# EAGLE design DP_current_measure_V3_extension (EAGLE 9.6.0)
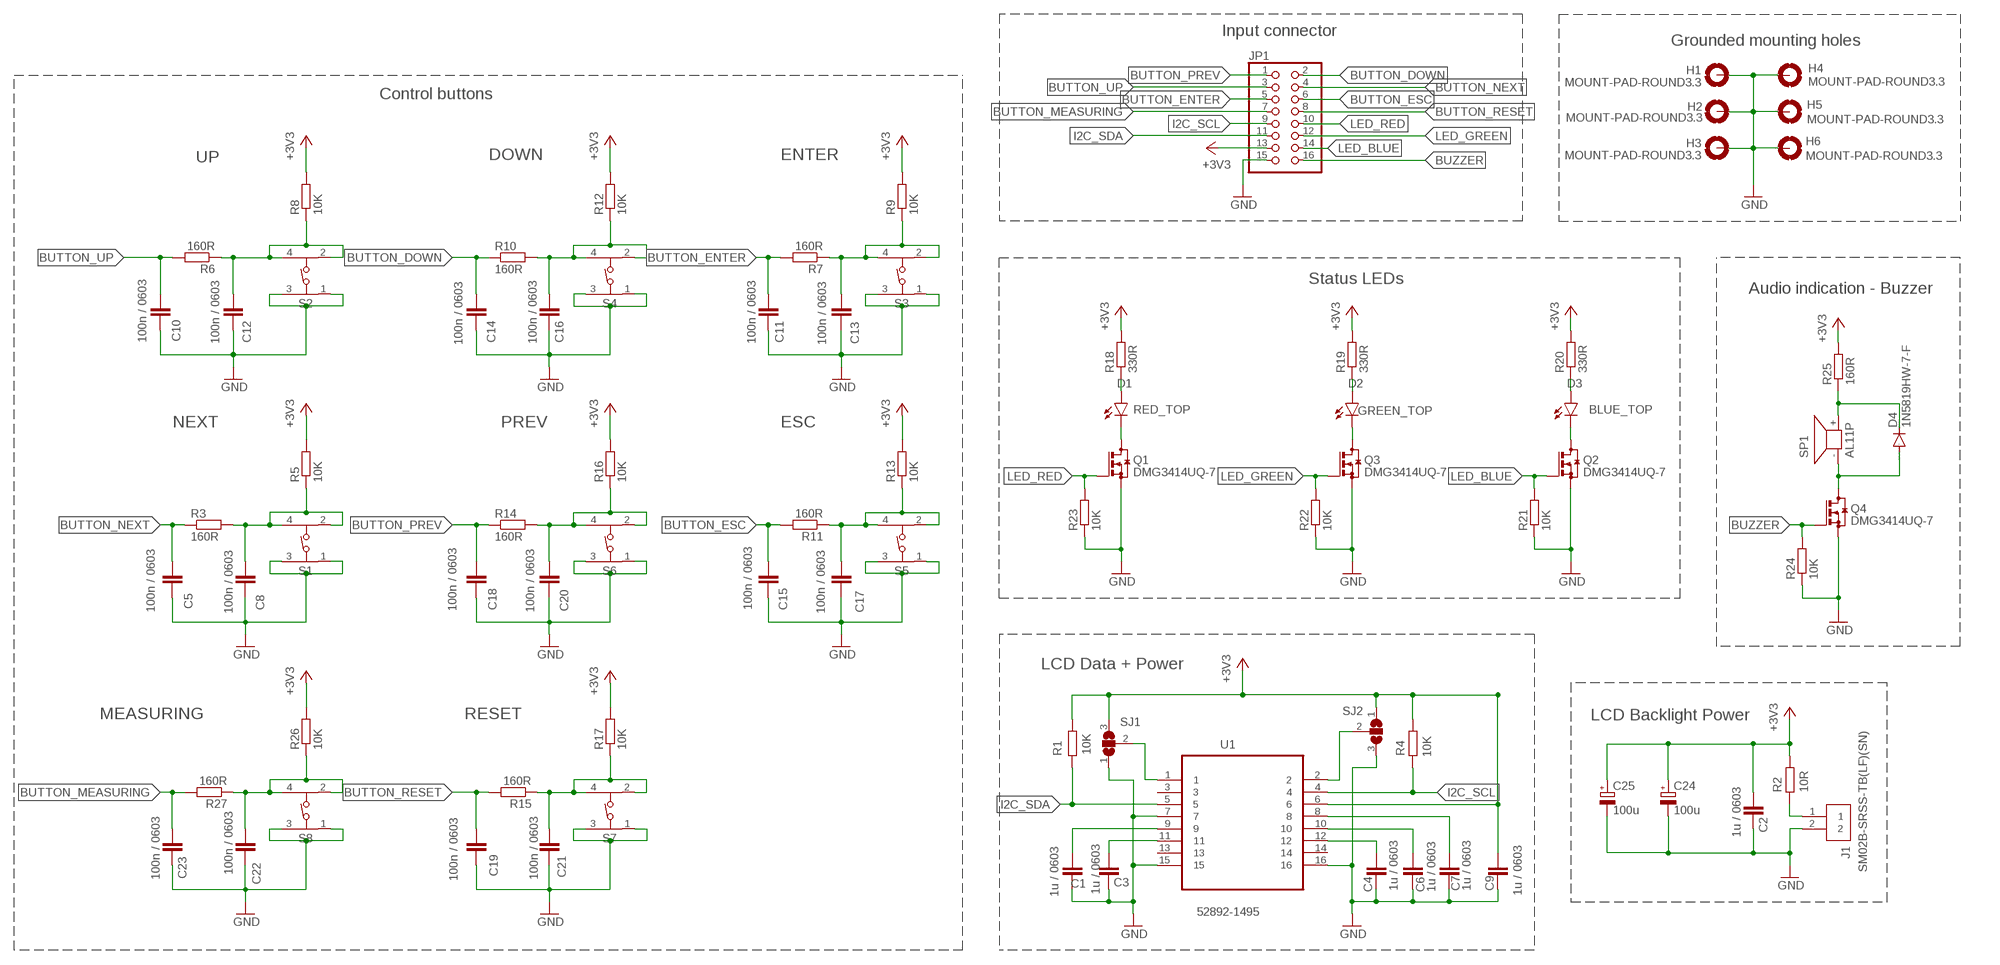
[diagram p0: schematic, sheet 1]

## Parts
C1  1u / 0603  C-EUC0603  [C0603]
C2  1u / 0603  C-EUC0603  [C0603]
C3  1u / 0603  C-EUC0603  [C0603]
C4  1u / 0603  C-EUC0603  [C0603]
C5  100n / 0603  C-EUC0603  [C0603]
C6  1u / 0603  C-EUC0603  [C0603]
C7  1u / 0603  C-EUC0603  [C0603]
C8  100n / 0603  C-EUC0603  [C0603]
C9  1u / 0603  C-EUC0603  [C0603]
C10  100n / 0603  C-EUC0603  [C0603]
C11  100n / 0603  C-EUC0603  [C0603]
C12  100n / 0603  C-EUC0603  [C0603]
C13  100n / 0603  C-EUC0603  [C0603]
C14  100n / 0603  C-EUC0603  [C0603]
C15  100n / 0603  C-EUC0603  [C0603]
C16  100n / 0603  C-EUC0603  [C0603]
C17  100n / 0603  C-EUC0603  [C0603]
C18  100n / 0603  C-EUC0603  [C0603]
C19  100n / 0603  C-EUC0603  [C0603]
C20  100n / 0603  C-EUC0603  [C0603]
C21  100n / 0603  C-EUC0603  [C0603]
C22  100n / 0603  C-EUC0603  [C0603]
C23  100n / 0603  C-EUC0603  [C0603]
C24  100u  CPOL-EUSMCB  [SMC_B]
C25  100u  CPOL-EUSMCB  [SMC_B]
D1  RED_TOP  LTST-C190KRKT  [LED-0603]
D2  GREEN_TOP  LTST-C190KRKT  [LED-0603]
D3  BLUE_TOP  LTST-C190KRKT  [LED-0603]
D4  1N5819HW-7-F  CGRM4001-G  [SOD-123_MINI-SMA]
H1  MOUNT-PAD-ROUND3.3  [3,3-PAD]
H2  MOUNT-PAD-ROUND3.3  [3,3-PAD]
H3  MOUNT-PAD-ROUND3.3  [3,3-PAD]
H4  MOUNT-PAD-ROUND3.3  [3,3-PAD]
H5  MOUNT-PAD-ROUND3.3  [3,3-PAD]
H6  MOUNT-PAD-ROUND3.3  [3,3-PAD]
J1  SM02B-SRSS-TB(LF)(SN)  [SM02B-SRSS-TB(LF)(SN)]
JP1  PINHD-2X8  [2X08]
Q1  DMG3414UQ-7  BSS123  [SOT23]
Q2  DMG3414UQ-7  BSS123  [SOT23]
Q3  DMG3414UQ-7  BSS123  [SOT23]
Q4  DMG3414UQ-7  BSS123  [SOT23]
R1  10K  R-EU_R0603  [R0603]
R2  10R  R-EU_R0603  [R0603]
R3  160R  R-EU_R0603  [R0603]
R4  10K  R-EU_R0603  [R0603]
R5  10K  R-EU_R0603  [R0603]
R6  160R  R-EU_R0603  [R0603]
R7  160R  R-EU_R0603  [R0603]
R8  10K  R-EU_R0603  [R0603]
R9  10K  R-EU_R0603  [R0603]
R10  160R  R-EU_R0603  [R0603]
R11  160R  R-EU_R0603  [R0603]
R12  10K  R-EU_R0603  [R0603]
R13  10K  R-EU_R0603  [R0603]
R14  160R  R-EU_R0603  [R0603]
R15  160R  R-EU_R0603  [R0603]
R16  10K  R-EU_R0603  [R0603]
R17  10K  R-EU_R0603  [R0603]
R18  330R  R-EU_R0603  [R0603]
R19  330R  R-EU_R0603  [R0603]
R20  330R  R-EU_R0603  [R0603]
R21  10K  R-EU_R0603  [R0603]
R22  10K  R-EU_R0603  [R0603]
R23  10K  R-EU_R0603  [R0603]
R24  10K  R-EU_R0603  [R0603]
R25  160R  R-EU_R0603  [R0603]
R26  10K  R-EU_R0603  [R0603]
R27  160R  R-EU_R0603  [R0603]
S1  430152095826  [430152095826]
S2  430152095826  [430152095826]
S3  430152095826  [430152095826]
S4  430152095826  [430152095826]
S5  430152095826  [430152095826]
S6  430152095826  [430152095826]
S7  430152095826  [430152095826]
S8  430152095826  [430152095826]
SJ1  SJ2W  [SJ_2]
SJ2  SJ2W  [SJ_2]
SP1  AL11P  [AL11P]
U1  52892-1495  [MOLEX_52892-1495]

## Nets
+3V3: C2.1 C9.1 C24.+ C25.+ JP1.13 R1.2 R2.2 R4.2 R5.2 R8.2 R9.2 R12.2 R13.2 R16.2 R17.2 R18.2 R19.2 R20.2 R25.2 R26.2 SJ1.3 SJ2.1 U1.6
BUTTON_DOWN: C14.1 JP1.2 R10.1
BUTTON_ENTER: C11.1 JP1.5 R7.2
BUTTON_ESC: C15.1 JP1.6 R11.2
BUTTON_MEASURING: C23.1 JP1.7 R27.2
BUTTON_NEXT: C5.1 JP1.4 R3.1
BUTTON_PREV: C18.1 JP1.1 R14.1
BUTTON_RESET: C19.1 JP1.8 R15.2
BUTTON_UP: C10.1 JP1.3 R6.2
BUZZER: JP1.16 Q4.1(G) R24.2
GND: C1.2 C2.2 C3.2 C4.2 C5.2 C6.2 C7.2 C8.2 C9.2 C10.2 C11.2 C12.2 C13.2 C14.2 C15.2 C16.2 C17.2 C18.2 C19.2 C20.2 C21.2 C22.2 C23.2 C24.- C25.- H1.B3,3(MOUNT) H2.B3,3(MOUNT) H3.B3,3(MOUNT) H4.B3,3(MOUNT) H5.B3,3(MOUNT) H6.B3,3(MOUNT) J1.2 JP1.15 Q1.2(S) Q2.2(S) Q3.2(S) Q4.2(S) R21.1 R22.1 R23.1 R24.1 S1.1 S1.3 S2.1 S2.3 S3.1 S3.3 S4.1 S4.3 S5.1 S5.3 S6.1 S6.3 S7.1 S7.3 S8.1 S8.3 SJ1.1 SJ2.3 U1.7 U1.15 U1.16
I2C_SCL: JP1.9 R4.1 U1.4
I2C_SDA: JP1.11 R1.1 U1.5
LED_BLUE: JP1.14 Q2.1(G) R21.2
LED_GREEN: JP1.12 Q3.1(G) R22.2
LED_RED: JP1.10 Q1.1(G) R23.2
N$1: SJ1.2 U1.1
N$2: J1.1 R2.1
N$3: C12.1 R6.1 R8.1 S2.2 S2.4
N$4: C22.1 R26.1 R27.1 S8.2 S8.4
N$5: C1.1 U1.9
N$6: C3.1 U1.11
N$7: C16.1 R10.2 R12.1 S4.2 S4.4
N$8: D1.C Q1.3(D)
N$9: SJ2.2 U1.2
N$10: C13.1 R7.1 R9.1 S3.2 S3.4
N$11: D1.A R18.1
N$12: C7.1 U1.8
N$13: C6.1 U1.10
N$14: C4.1 U1.12
N$15: D2.C Q3.3(D)
N$16: D2.A R19.1
N$17: D4.A Q4.3(D) SP1.-
N$18: D4.C R25.1 SP1.+
N$19: C20.1 R14.2 R16.1 S6.2 S6.4
N$20: C17.1 R11.1 R13.1 S5.2 S5.4
N$21: C21.1 R15.1 R17.1 S7.2 S7.4
N$22: D3.C Q2.3(D)
N$23: D3.A R20.1
N$24: C8.1 R3.2 R5.1 S1.2 S1.4
Unconnected: U1.3 U1.13 U1.14

## Notes on the sheet
- Input connector
- Grounded mounting holes
- Control buttons
- UP | DOWN | ENTER
- Status LEDs
- Audio indication - Buzzer
- NEXT | PREV | ESC
- LCD Data + Power
- MEASURING | RESET | LCD Backlight Power

## Library data of the parts
C1-C23 = rcl:C-EU: CAPACITOR, European symbol; SPICEPREFIX: C
C24 C25 = rcl:CPOL-EU: POLARIZED CAPACITOR, European symbol; SPICEPREFIX: C
D1-D3 = LED:LTST-C190KRKT: LED RED CLEAR CHIP SMD Manufacturer's datasheet <http://optoelectronics.liteon.com/upload/download/DS-22-99-0151/LTST-C190KRKT.pdf>; CREATED_BY: PCBLayout.com; DIGIKEY_PART_NUMBER: 160-1436-1-ND; MANUFACTURER: Lite-On Inc.; MPN: LTST-C190KRKT; PACKAGE: 0603
D4 = diode:CGRM400*-G: Molded plasitc,JEDEC SOD-123/Mini SMA Source: Comchip CGRM4001-G.pdf
H1-H6 = holes:MOUNT-PAD-ROUND: MOUNTING PAD, round
J1 = SM02B-SRSS-TB_LF__SN_:SM02B-SRSS-TB(LF)(SN): JST (JAPAN SOLDERLESS TERMINALS) - SM02B-SRSS-TB (LF)(SN) - HEADER, R/A, 2WAY Source: Datasheet <http://www.jst-mfg.com/product/pdf/eng/eSH.pdf>; AVAILABILITY: Unavailable; DESCRIPTION: Connector Header Surface Mount, Right Angle 2 position 0.039 _1.00mm_; MF: JST Sales; MP: SM02B-SRSS-TB_LF__SN_; PACKAGE: None; PRICE: None
JP1 = pinhead:PINHD-2X8: PIN HEADER
Q1-Q4 = transistor-small-signal:BSS123: N-CHANNEL MOS FET
R1-R27 = rcl:R-EU_: RESISTOR, European symbol; SPICEPREFIX: R
S1-S8 = Wurth_Switch_WS-TASV:430152095826: WS-TASV SMT Tact Switch 6x6 mm Material Properties Cover Material : Stainless Steel Properties Actuator Material:LCP Actuator Flammability :UL94 V-0 Rating Actuator Color:Black; Salmon; White Frame Material:LCP Flammability Rating:UL94 V-0 Frame Color:Black Contact Material:Stainless Steel Contact Plating:Silver Terminal Material:Copper Alloy Terminal Plating:Silver VR:12 V (DC) Contact Resistance Initial:100 mΩ Contact Resistance After Life Test:2Ω RISO:100 MΩ Withstanding Voltage:250 V (AC) Washable:No Qty.:4000;5000 Mechanical Properties Electrical Life:400; 550; 1000 Stroke :0.25 mm General Information Operating Temperature:-40 up to +85 °C Washable:No Packaging Properties Packaging:Tape and Reel <https://www.we-online.com/catalog/media/o37470v209%20Family_WS-TASV_6x6mm_SMD_Tact_Switch_4301820xx8xx.jpg> Details see: https://www.we-online.com/catalog/en/TASV_6X6_SMD/ Updated by yingchun,Shan;2020-02-18 2020(C) Würth Elektronik; DATASHEET-URL: https://www.we-online.com/catalog/datasheet/430152095826.pdf; H: 9mm; OPERATION-FORCE: 260g; PART-NUMBER: 430152095826; QTY: 400
SJ1 SJ2 = jumper:SJ2W: SMD solder JUMPER
SP1 = buzzer:AL11P: SPEAKER Source: Buerklin; OC_FARNELL: unknown; OC_NEWARK: unknown
U1 = 52892-1495:52892-1495: CONNECTOR, FPC, ZIF, 0.50MM, 14 WAY; AVAILABILITY: Unavailable; DESCRIPTION: Conn FFC/FPC Connector SKT 14 POS 0.5mm Solder RA SMD Embossed T/R; MF: Molex Connector; MP: 52892-1495; PACKAGE: None; PRICE: None

## Board
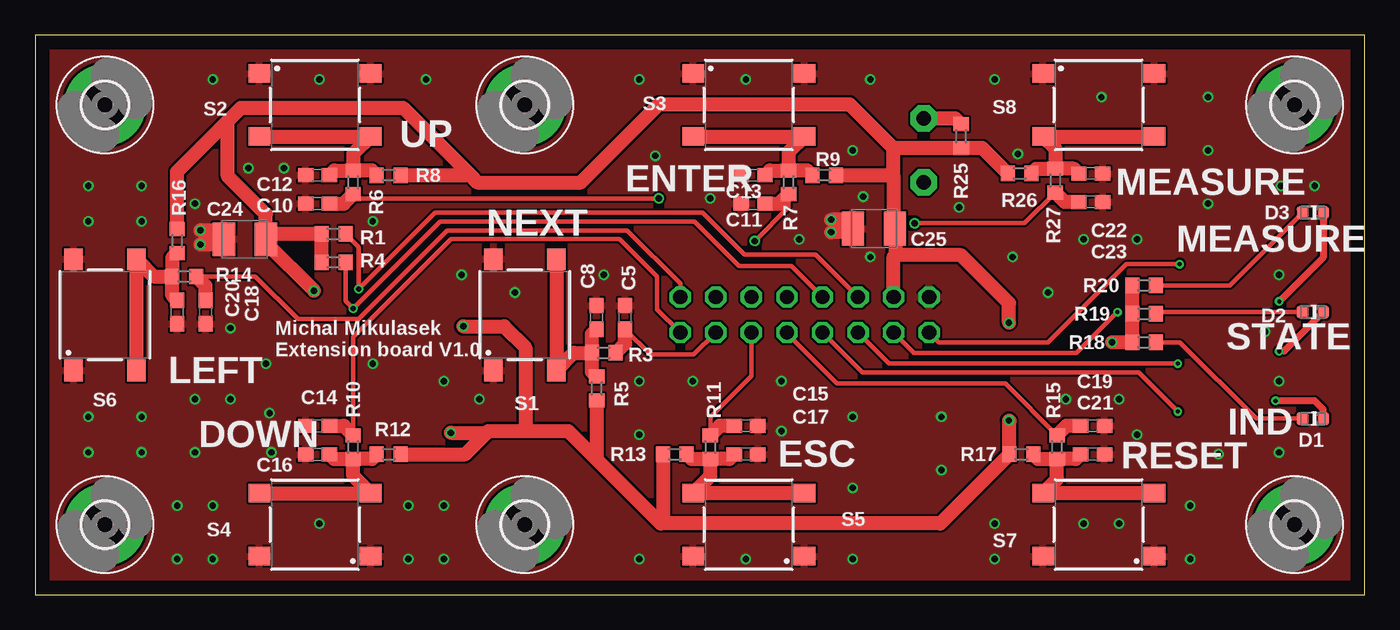
[diagram p1: board, top side]
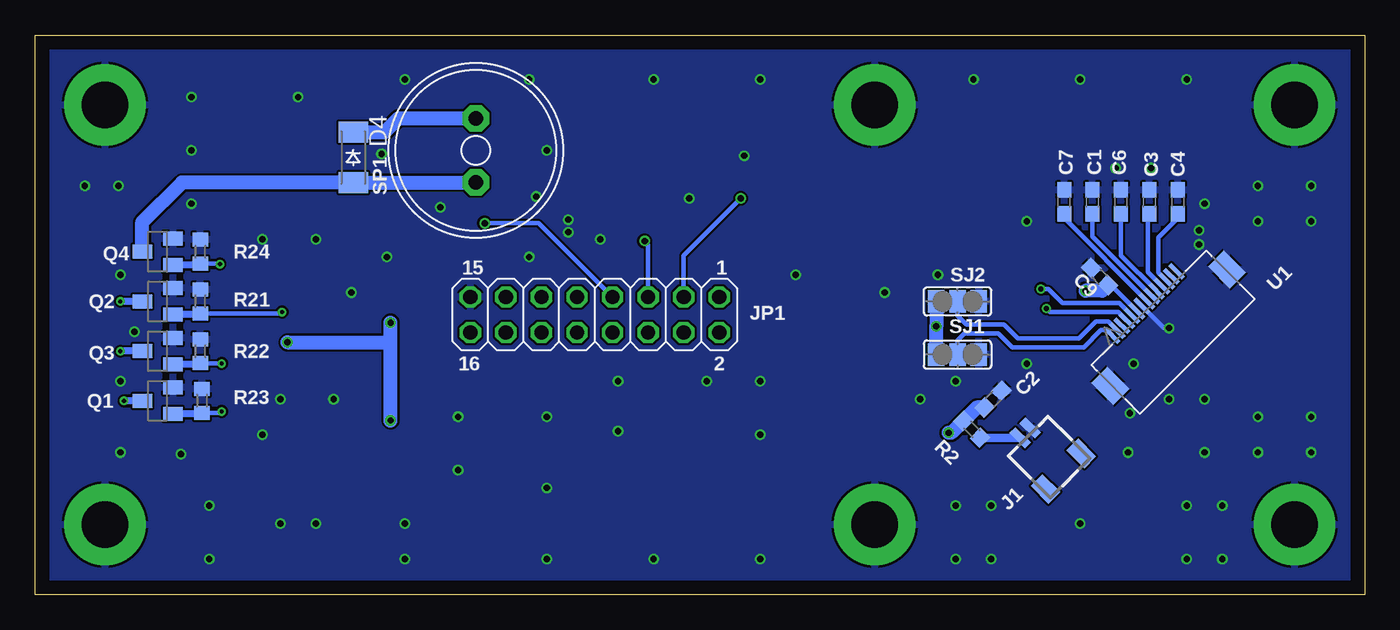
[diagram p2: board, bottom side, seen from below]

Size 95 x 40 mm. Coordinates in mm from the lower left corner, seen from the top.
Outline: 0,0 95,0 95,40 0,40 0,0
Copper layers (1+2*15+16): Top 0.035mm / dielectric 0.2mm / Route2 0.035mm / dielectric 1mm / Route15 0.035mm / dielectric 0.2mm / Bottom 0.035mm
Design rules "PCB_way_4L": minimum track width 6mil, minimum drill 0.3mm, track to track 6mil, track to pad 6mil, pad to pad 6mil, via to via 6mil, smd to smd 6mil, copper to edge 40mil, drill to drill 6mil, minimum pad ring 6mil, minimum via ring 6mil, stop-mask expansion 4mil, vias tented up to drill 0mil, thermal gap 6mil

### Footprints (pad centres in the part's own frame; a part is rotated, then mirrored left to right if it is on the bottom)
C0603 = smd 1.1 x 1: 1 -0.85,0; 2 0.85,0
SMC_B = smd 1.6 x 2.4: + -1.5,0; - 1.5,0
LED-0603 = smd 0.86 x 0.93: A 0.735,0; C -0.735,0
SOD-123_MINI-SMA = smd 1.5 x 2.1: A 1.8,0; C -1.8,0
3,3-PAD = drill 3.3 pad 5.842: B3,3 0,0
SM02B-SRSS-TB(LF)(SN) = smd 0.6 x 1.55: 1 -0.5,1.975; 2 0.5,1.975 | smd 1.2 x 1.8: 3 -1.8,-1.9; 4 1.8,-1.9
2X08 = drill 1.016 octagon: 1 -8.89,-1.27; 2 -8.89,1.27; 3 -6.35,-1.27; 4 -6.35,1.27; 5 -3.81,-1.27; 6 -3.81,1.27; 7 -1.27,-1.27; 8 -1.27,1.27; 9 1.27,-1.27; 10 1.27,1.27; 11 3.81,-1.27; 12 3.81,1.27; 13 6.35,-1.27; 14 6.35,1.27; 15 8.89,-1.27; 16 8.89,1.27
SOT23 = smd 1 x 1.4: 1 -0.95,-1.1; 2 0.95,-1.1; 3 0,1.1
R0603 = smd 1 x 1.1: 1 -0.85,0; 2 0.85,0
430152095826 = smd 1.55 x 1.3: 1 -3.975,2.25; 2 -3.975,-2.25; 3 3.975,2.25; 4 3.975,-2.25
SJ_2 = smd 1.168 x 1.6: 1 -1.524,0; 2 0,0; 3 1.524,0
AL11P = drill 1.016 pad 1.905 octagon: + 2.286,0; - -2.286,0
MOLEX_52892-1495 = smd 0.305 x 1.397: 1 3.251,2.896; 2 2.743,2.896; 3 2.261,2.896; 4 1.753,2.896; 5 1.245,2.896; 6 0.762,2.896; 7 0.254,2.896; 8 -0.254,2.896; 9 -0.762,2.896; 10 -1.245,2.896; 11 -1.753,2.896; 12 -2.261,2.896; 13 -2.743,2.896; 14 -3.251,2.896 | smd 1.6 x 2.21: 15 -5.893,5.359; 16 5.893,5.359

### Placement (x,y rotation side)
C1  19.43,28.07 90 bottom
C2  26.54,13.97 45 bottom
C3  15.37,28.07 90 bottom
C4  13.34,28.07 90 bottom
C5  42.16,19.81 90 top
C6  17.4,28.07 90 bottom
C7  21.46,28.07 90 bottom
C8  40.13,19.81 90 top
C9  18.92,22.73 135 bottom
C10  20.19,27.94 180 top
C11  51.31,27.94 180 top
C12  20.19,29.97 180 top
C13  51.31,29.97 180 top
C14  20.19,12.06 180 top
C15  50.8,12.06 0 top
C16  20.19,10.03 180 top
C17  50.8,10.03 0 top
C18  12.19,20.19 270 top
C19  75.56,12.06 0 top
C20  10.16,20.19 270 top
C21  75.56,10.03 0 top
C22  75.44,30.1 0 top
C23  75.44,28.07 0 top
C24  14.99,25.4 180 top
C25  59.94,26.16 180 top
D1  91.31,12.57 180 top
D2  91.31,20.19 180 top
D3  91.31,27.3 180 top
D4  72.26,31.24 270 bottom
H1  5,5 0 top
H2  90,5 0 top
H3  90,35 0 top
H4  5,35 0 top
H5  35,5 0 top
H6  35,35 0 top
J1  22.86,10.16 45 bottom
JP1  55,20 180 bottom
Q1  86.23,13.84 90 bottom
Q2  86.23,20.95 90 bottom
Q3  86.23,17.4 90 bottom
Q4  86.23,24.51 90 bottom
R1  21.34,25.78 180 top
R2  28.07,11.81 135 bottom
R3  40.64,17.27 180 top
R4  21.34,23.75 180 top
R5  40.13,14.73 270 top
R6  22.73,29.46 270 top
R7  53.85,29.46 270 top
R8  25.27,29.97 0 top
R9  56.39,29.97 0 top
R10  22.73,10.54 270 top
R11  48.26,10.54 90 top
R12  25.27,10.03 0 top
R13  45.72,10.03 180 top
R14  10.67,22.73 180 top
R15  73.03,10.54 90 top
R16  10.16,25.27 90 top
R17  70.48,10.03 180 top
R18  79.25,18.03 180 top
R19  79.25,20.07 180 top
R20  79.25,22.1 180 top
R21  83.19,20.95 270 bottom
R22  83.19,17.4 270 bottom
R23  83.06,13.84 270 bottom
R24  83.19,24.51 270 bottom
R25  66.17,32.77 270 top
R26  70.36,30.1 180 top
R27  72.9,29.59 270 top
S1  35,20 90 top
S2  20,35 0 top
S3  51,35 0 top
S4  20,5 180 top
S5  51,5 180 top
S6  5,20 90 top
S7  76,5 180 top
S8  76,35 0 top
SJ1  29.08,17.14 180 bottom
SJ2  29.08,20.95 0 bottom
SP1  63.5,31.75 90 bottom
U1  17.78,22.86 225 bottom

### Tracks (layer width: path | path; a pad name or v marks a point on that pad's centre or on a via)
+3V3  (via drill 0.45)
  Top 1.016: 61.34,31.92 58.2,35.05 44.58,35.05 38.99,29.46 31.62,29.46 31.11,29.97 | R20.2 R19.2 R18.2 v76.96,18.03 | R26.2 67.69,31.92 R25.2 61.34,31.92 | JP1.13 61.35,24.13 61.48,24.26 | 61.35,29.84 61.35,31.91 61.34,31.92 | R16.2 10.16,30.23 13.78,33.85 | 13.78,33.85 14.73,34.8 26.29,34.8 31.11,29.97 | 13.78,33.85 13.78,29.91 16.49,27.2 16.49,25.91 | R9.2 61.22,29.97 61.35,29.84 | 44.7,5.08 64.68,5.08 R17.2 69.64,12.41 v69.6,12.45 | 44.7,5.08 40.13,9.65 | 40.13,9.65 38.1,11.68 35.05,11.68 | v69.6,19.43 69.6,20.83 66.17,24.26 61.48,24.26 | 32.26,11.56 30.73,10.03 R12.2 | 35.05,11.68 32.38,11.68 32.26,11.56 | R13.2 44.87,5.25 44.7,5.08 | R8.2 31.11,29.97 | v30.61,19.18 33.53,19.18 35.05,17.65 35.05,11.68 | R4.2 R1.2 16.61,25.78 16.49,25.91 | R5.2 40.13,9.65 | v29.72,11.56 32.26,11.56 | 16.49,25.91 C24.+ 16.49,25.17 v19.94,21.72 | 61.35,29.84 61.35,26.26 C25.+ 61.48,26.13 61.48,24.26
  Bottom 0.305: U1.6 18.13,22.13 C9.1
  Bottom 1.016: C9.1 18.74,21.72 v19.94,21.72 | v69.6,12.45 69.6,18.03 | 69.6,18.03 v69.6,19.43 | SJ2.1 v30.61,19.18 SJ1.3 | v76.96,18.03 69.6,18.03 | v29.72,11.56 29.52,11.56 R2.2 27.71,13.37 C2.1
BUTTON_DOWN
  Top 0.305: R10.1 22.73,18.41 29.72,25.4 41.78,25.4 44.45,22.73 44.45,20.39 JP1.2
  Top 1.016: C14.1 22.06,12.06 R10.1
BUTTON_ENTER  (via drill 0.45)
  Top 0.305: R7.2 53.85,27.69 v51.44,25.27
  Top 1.016: C11.1 53.17,27.94 R7.2
  Bottom 0.305: JP1.5 51.19,25.03 v51.44,25.27
BUTTON_ESC
  Top 0.305: R11.2 48.26,12.7 51.19,15.63 JP1.6
  Top 1.016: C15.1 48.93,12.06 R11.2
BUTTON_MEASURING  (via drill 0.45)
  Top 0.305: R27.2 70.7,26.54 v62.87,26.54
  Top 1.016: C23.1 73.57,28.07 R27.2
  Bottom 0.305: v62.87,26.54 59,26.54 JP1.7
BUTTON_NEXT
  Top 0.305: C5.1 43.98,17.14 47.06,17.14 JP1.4
  Top 1.016: R3.1 42.16,17.95 C5.1
BUTTON_PREV
  Top 0.305: R14.1 15.75,22.73 18.8,19.68 23.11,19.68 29.46,26.04 42.29,26.04 46.11,22.22 JP1.1
  Top 1.016: C18.1 12.19,22.06 R14.1
BUTTON_RESET
  Top 0.305: R15.2 69.34,15.07 57.32,15.07 53.73,18.66 JP1.8
  Top 1.016: C19.1 73.7,12.06 R15.2
BUTTON_UP  (via drill 0.45)
  Top 0.305: R6.2 23.03,28.32 v44.58,28.32
  Top 1.016: C10.1 22.06,27.94 R6.2
  Bottom 0.305: JP1.3 48.65,24.25 v44.58,28.32
BUZZER  (via drill 0.3)
  Top 0.305: v81.79,23.62 77.98,23.62 72.39,18.03 64.59,18.03 JP1.16
  Bottom 0.305: R24.2 81.83,23.66 v81.79,23.62
  Bottom 0.508: R24.2 83.28,23.56 Q4.1
GND  (via drill 0.45)
  Top 1.016: v11.81,26.04 12.85,26.04 C24.- 13.11,25.02 v11.81,25.02 | v56.9,26.8 57.81,26.8 C25.- 58.19,25.91 v56.9,25.91
  Bottom 0.305: U1.7 14.33,19.05 v13.97,19.05
  other vias: 3.81,29.21 7.62,29.21 7.62,26.67 3.81,26.67 3.81,12.7 7.62,12.7 7.62,10.16 3.81,10.16 12.7,2.54 12.7,6.35 10.16,6.35 10.16,2.54 26.67,2.54 26.67,6.35 29.21,6.35 29.21,2.54 29.21,15.24 24.13,16.51 30.48,22.86 40.64,22.86 43.18,15.24 43.18,11.43 46.99,15.24 53.34,15.24 53.34,11.68 58.42,7.62 58.42,2.54 43.18,2.54 68.58,2.54 68.58,5.08 74.93,5.08 77.47,5.08 82.55,2.54 82.55,6.35 73.66,13.97 77.47,13.97 78.74,11.43 84.58,10.03 88.9,10.16 88.9,15.24 87.88,18.8 88.9,22.86 91.44,29.21 89.03,29.21 83.82,31.75 83.82,35.56 70.23,31.5 68.58,36.83 76.2,35.56 59.69,36.83 50.8,36.83 43.18,36.83 58.42,31.75 59.18,28.45 54.61,25.4 48.26,28.32 44.32,31.37 59.69,24.13 69.85,24.13 72.39,21.59 74.93,25.4 78.74,25.4 83.82,27.94 58.42,12.7 64.77,12.7 64.77,8.89 16.89,10.16 16.76,12.95 16.51,16.51 13.97,13.97 11.43,27.94 12.7,36.83 20.32,36.83 27.94,36.83 34.29,21.59 20.32,5.08 50.8,2.54 24.13,26.67 15.24,30.48 17.78,30.48 11.43,10.16 11.43,13.97 31.75,13.97 66.04,27.69
  pour Bottom: -7.62,43.18 -7.62,-2.54 95.25,-2.54 95.25,43.18
  pour Top: -3.81,43.18 -3.81,-2.54 95.25,-2.54 95.25,43.18
I2C_SCL  (via drill 0.35)
  Top 0.305: R4.1 22.19,20.99 v22.73,20.45 v22.74,20.45 28.96,26.67 47.12,26.67 50.29,23.5 54.05,23.5 JP1.9
  Bottom 0.305: U1.4 17.59,20.19 22.48,20.19 v22.73,20.45
I2C_SDA  (via drill 0.35)
  Top 0.305: R1.1 23.12,24.85 v23.12,21.84 v23.11,21.84 28.57,27.3 47.71,27.3 50.7,24.31 55.77,24.31 JP1.11
  Bottom 0.305: U1.5 17.51,20.83 21.59,20.83 22.61,21.84 v23.11,21.84
LED_BLUE  (via drill 0.3)
  Top 0.305: v77.34,20.19 74.42,17.27 62.81,17.27 JP1.14
  Bottom 0.305: R21.2 77.43,20.11 v77.34,20.19
  Bottom 0.508: R21.2 83.28,20 Q2.1
LED_GREEN  (via drill 0.3)
  Top 0.305: v81.66,16.51 61.03,16.51 JP1.12
  Bottom 0.305: R22.2 83.15,16.51 v81.66,16.51
  Bottom 0.508: R22.2 83.28,16.45 Q3.1
LED_RED  (via drill 0.3)
  Top 0.305: v81.66,13.08 78.87,15.88 59.12,15.88 JP1.10
  Bottom 0.305: R23.2 81.75,12.99 v81.66,13.08
  Bottom 0.508: R23.2 83.16,12.89 Q1.1
N$1
  Bottom 0.305: U1.1 18.41,18.89 18.82,18.89 20.07,17.65 25.15,17.65 26.16,18.67 28.57,18.67 29.08,18.16 SJ1.2
N$2
  Bottom 0.61: J1.1 R2.1
N$3
  Top 1.016: S2.2 S2.4 22.73,31.51 R6.1 | R8.1 24.08,30.31 R6.1 | C12.1 21.39,30.31 R6.1
N$4
  Top 1.016: R26.1 71.55,30.44 R27.1 | C22.1 74.25,30.44 R27.1 | S8.4 S8.2 72.9,31.88 R27.1
N$5
  Bottom 0.305: U1.9 19.43,25.59 C1.1
N$6
  Bottom 0.305: U1.11 15.49,23.05 15.49,27.09 C3.1
N$7
  Top 1.016: S4.4 S4.2 22.73,8.49 R10.2 | R12.1 24.08,9.69 R10.2 | C16.1 21.39,9.69 R10.2
N$8  (via drill 0.3)
  Top 0.508: D1.C 92.05,13.23 91.44,13.84 v88.65,13.84
  Bottom 0.508: Q1.3 v88.65,13.84
N$9
  Bottom 0.305: U1.2 18.31,19.51 19.2,19.51 20.42,18.29 24.77,18.29 25.78,19.3 28.45,19.3 29.08,19.94 SJ2.2
N$10
  Top 1.016: R9.1 55.2,30.31 R7.1 | C13.1 52.5,30.31 R7.1 | S3.2 S3.4 53.85,31.62 R7.1
N$11
  Top 0.305: R18.1 81.81,18.03 87.28,12.57 D1.A
N$12
  Bottom 0.305: U1.8 21.46,26.9 C7.1
N$13
  Bottom 0.305: U1.10 17.4,24.24 C6.1
N$14
  Bottom 0.305: U1.12 14.73,23.01 14.73,25.53 13.34,26.92 C4.1
N$15  (via drill 0.3)
  Top 0.508: D2.C 89.25,17.4 v88.9,17.4
  Bottom 0.508: Q3.3 v88.9,17.4
N$16
  Top 0.305: D2.A 80.22,20.19 R19.1
N$17
  Bottom 1.016: Q4.3 87.33,26.63 84.5,29.46 84.47,29.44 D4.A 63.52,29.44 SP1.-
N$18
  Top 1.016: SP1.+ 65.75,34.04 R25.1
  Bottom 1.016: SP1.+ 69.03,34.04 70.03,33.04 D4.C
N$19
  Top 1.016: S6.2 S6.4 8.49,22.73 R14.2 | R16.1 9.82,24.08 R14.2 | C20.1 9.82,21.39 R14.2
N$20
  Top 1.016: S5.2 S5.4 48.26,8.48 R11.1 | R13.1 46.91,9.69 R11.1 | C17.1 49.61,9.69 R11.1
N$21
  Top 1.016: S7.2 S7.4 73.03,8.25 R15.1 | R17.1 71.68,9.69 R15.1 | C21.1 74.37,9.69 R15.1
N$22  (via drill 0.3)
  Top 0.508: D3.C 92.05,24.1 v88.9,20.95
  Bottom 0.508: Q2.3 v88.9,20.95
N$23
  Top 0.305: R20.1 85.37,22.1 D3.A
N$24
  Top 1.016: S1.4 S1.2 38.5,17.27 R3.2 | R3.2 39.79,18.62 C8.1 | R5.1 39.79,15.92 R3.2

### Text on the board
tPlace: UP | ENTER | MEASURE | NEXT | MEASURE | STATE | Michal Mikulasek / Extension board V1.0 | LEFT | DOWN | IND | ESC | RESET
bPlace: 1 | 15 | 2 | 16